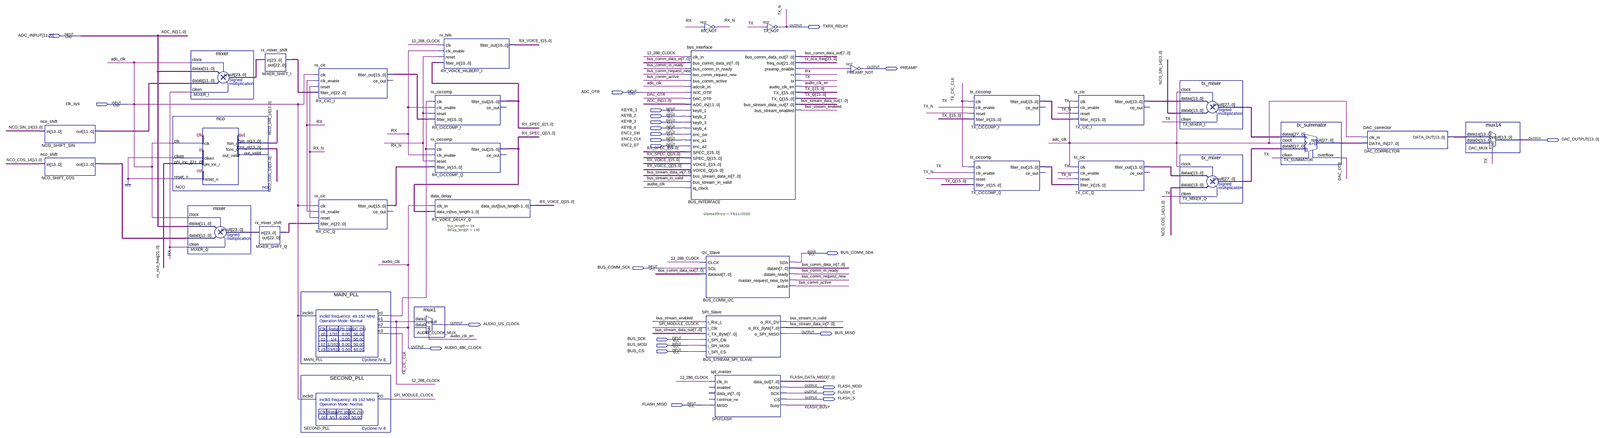
[diagram p0: schematic sheet, whole]
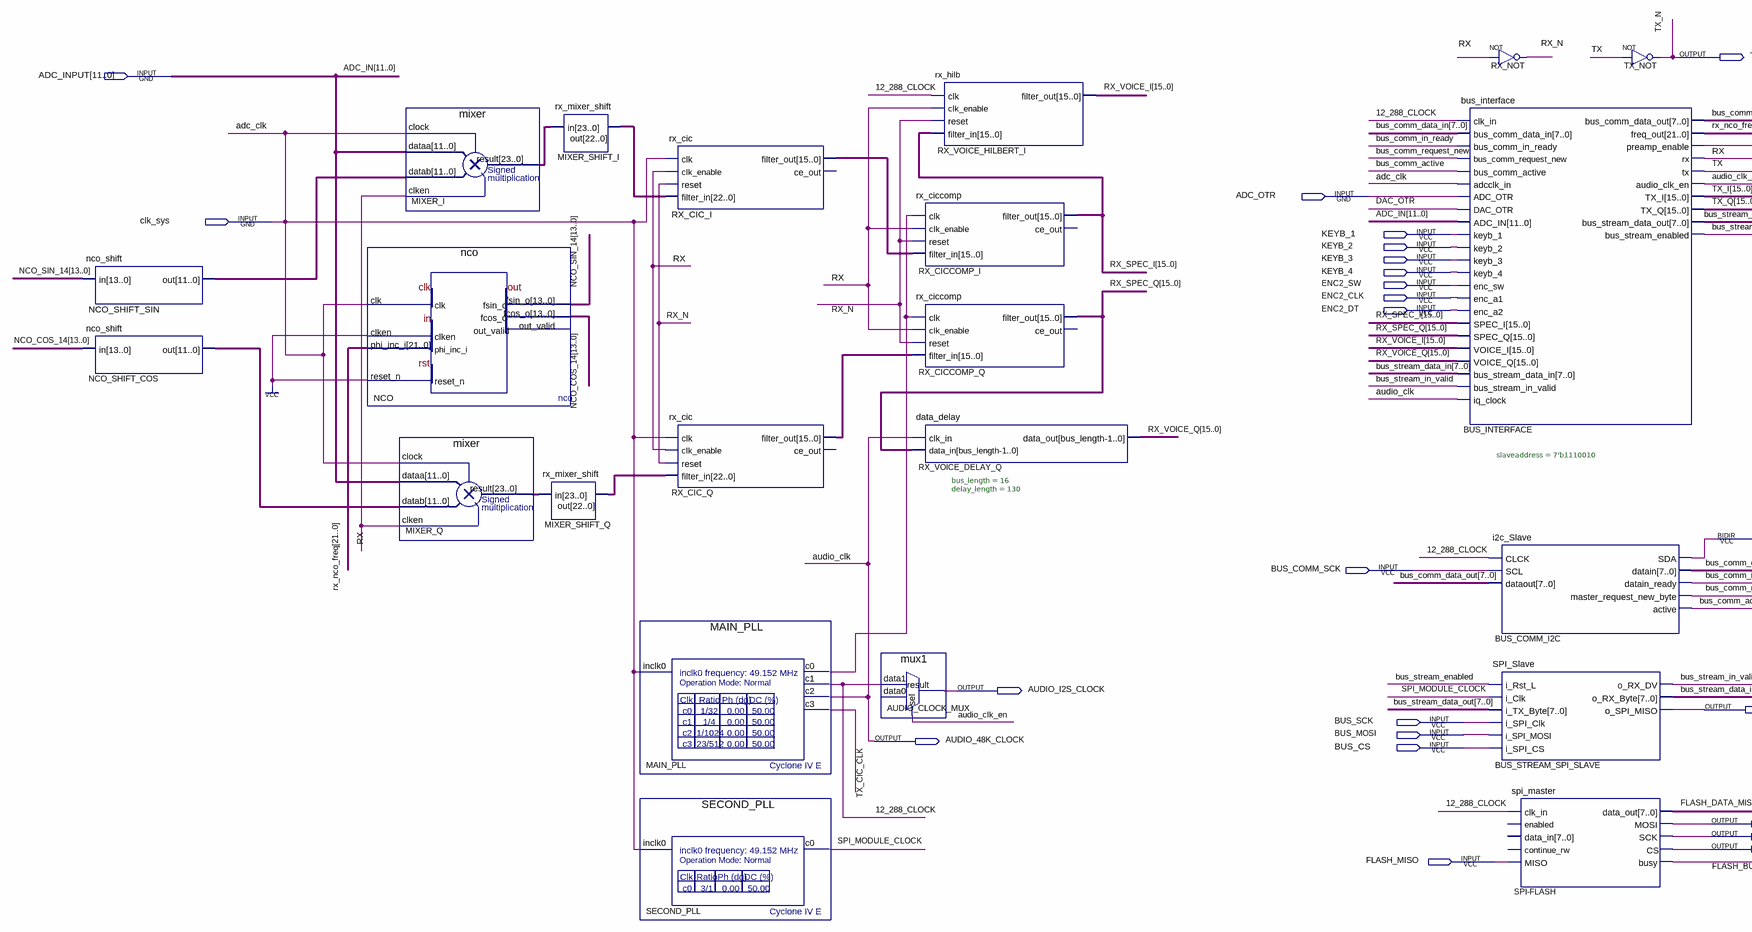
[diagram p1: schematic sheet, left part]
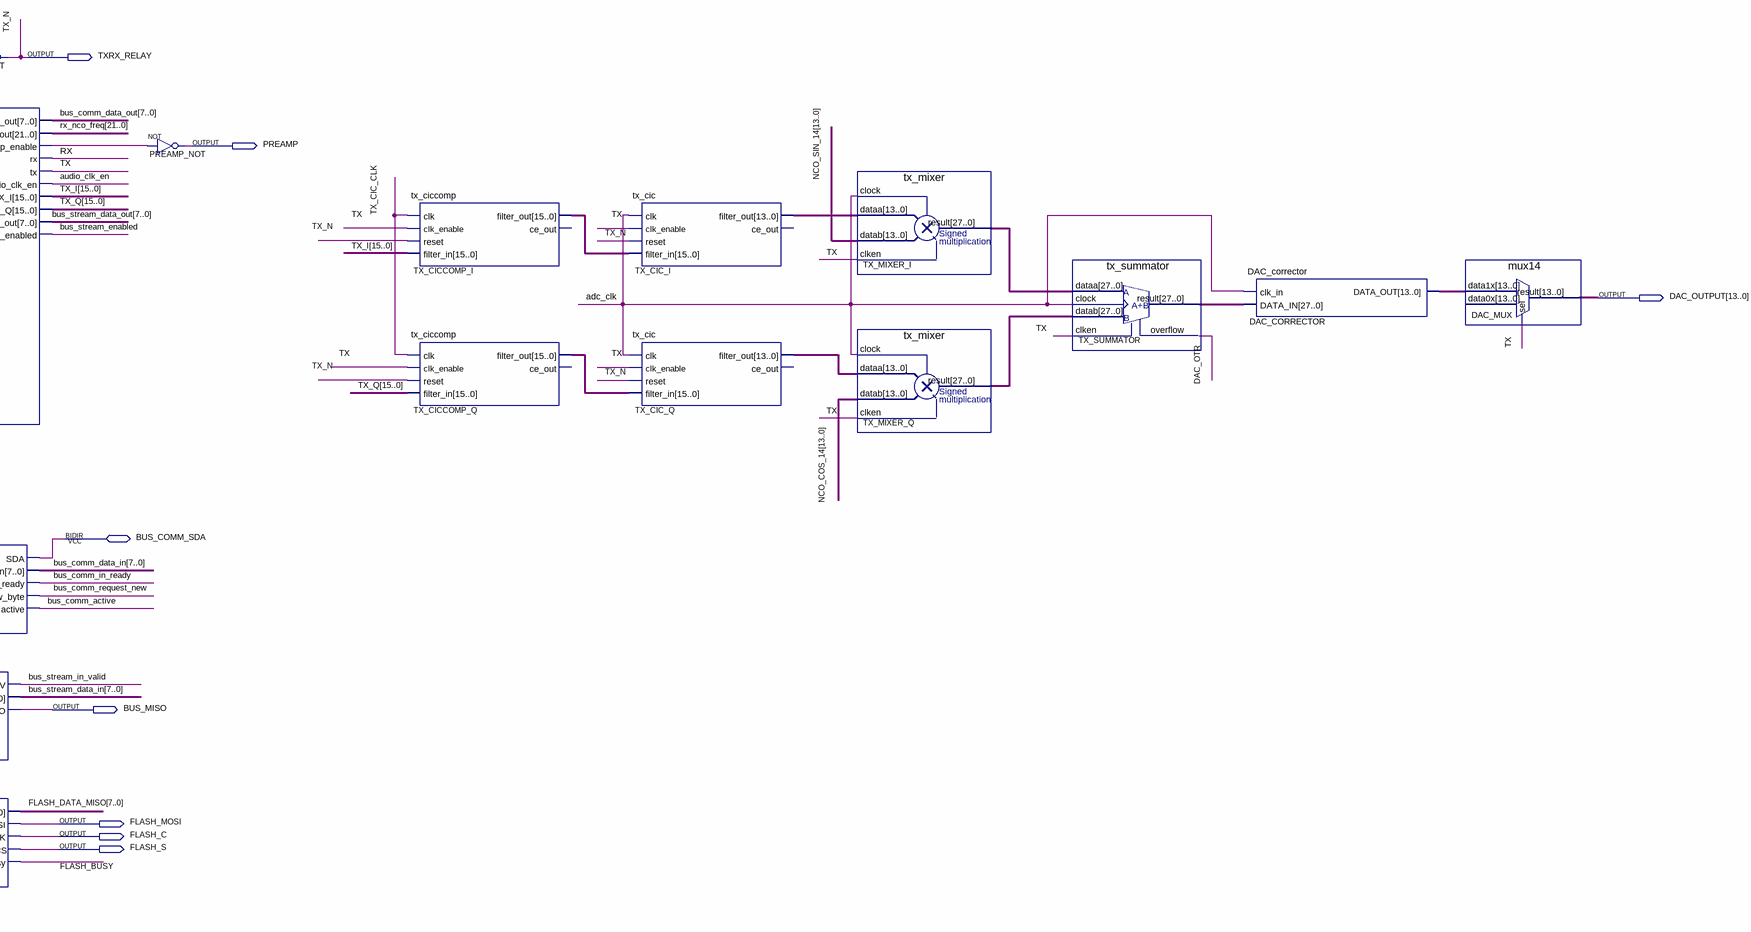
[diagram p2: schematic sheet, right part]
// Quartus schematic UA3REO.bdf as structural Verilog: 32 symbols, 25 pins
module UA3REO (
  input  [11:0] ADC_INPUT,
  input  ADC_OTR,
  input  clk_sys,
  input  KEYB_1,
  input  KEYB_2,
  input  KEYB_3,
  input  KEYB_4,
  input  ENC2_SW,
  input  ENC2_CLK,
  input  ENC2_DT,
  input  BUS_COMM_SCK,
  input  BUS_SCK,
  input  BUS_MOSI,
  input  BUS_CS,
  input  FLASH_MISO,
  inout  BUS_COMM_SDA,
  output TXRX_RELAY,
  output PREAMP,
  output [13:0] DAC_OUTPUT,
  output AUDIO_I2S_CLOCK,
  output BUS_MISO,
  output AUDIO_48K_CLOCK,
  output FLASH_MOSI,
  output FLASH_C,
  output FLASH_S
);

  wire \12_288_CLOCK , audio_clk_en, bus_comm_active, bus_comm_in_ready, bus_comm_request_new,
       BUS_INTERFACE_preamp_enable, bus_stream_enabled, bus_stream_in_valid, DAC_OTR, FLASH_BUSY,
       MAIN_PLL_c0, RX, RX_N, SPI_MODULE_CLOCK, TX, TX_CIC_CLK;
  wire [7:0] bus_comm_data_in, bus_comm_data_out, bus_stream_data_in, bus_stream_data_out, FLASH_DATA_MISO;
  wire [11:0] NCO_SHIFT_COS_out, NCO_SHIFT_SIN_out;
  wire [13:0] DAC_CORRECTOR_data_out, NCO_COS_14, NCO_SIN_14, TX_CIC_I_filter_out, TX_CIC_Q_filter_out;
  wire [15:0] RX_CIC_I_filter_out, RX_CIC_Q_filter_out, RX_SPEC_I, RX_SPEC_Q, RX_VOICE_I, RX_VOICE_Q,
       TX_CICCOMP_I_filter_out, TX_CICCOMP_Q_filter_out, TX_I, TX_Q;
  wire [21:0] rx_nco_freq;
  wire [22:0] MIXER_SHIFT_I_out, MIXER_SHIFT_Q_out;
  wire [23:0] MIXER_I_result, MIXER_Q_result;
  wire [27:0] TX_MIXER_I_result, TX_MIXER_Q_result, TX_SUMMATOR_result;

  nco_shift NCO_SHIFT_SIN (.in(NCO_SIN_14), .out(NCO_SHIFT_SIN_out));
  nco_shift NCO_SHIFT_COS (.in(NCO_COS_14), .out(NCO_SHIFT_COS_out));
  nco NCO (
    .clk(clk_sys), .clken(1'b1), .phi_inc_i(rx_nco_freq), .reset_n(1'b1), .fsin_o(NCO_SIN_14),
    .fcos_o(NCO_COS_14));  // open: out_valid
  mixer MIXER_I (.clock(clk_sys), .dataa(ADC_INPUT), .datab(NCO_SHIFT_SIN_out), .clken(RX), .result(MIXER_I_result));
  mixer MIXER_Q (.clock(clk_sys), .dataa(ADC_INPUT), .datab(NCO_SHIFT_COS_out), .clken(RX), .result(MIXER_Q_result));
  rx_mixer_shift MIXER_SHIFT_Q (.in(MIXER_Q_result), .out(MIXER_SHIFT_Q_out));
  rx_mixer_shift MIXER_SHIFT_I (.in(MIXER_I_result), .out(MIXER_SHIFT_I_out));
  MAIN_PLL MAIN_PLL (.inclk0(clk_sys), .c0(MAIN_PLL_c0), .c1(\12_288_CLOCK ), .c2(AUDIO_48K_CLOCK), .c3(TX_CIC_CLK));
  SECOND_PLL SECOND_PLL (.inclk0(clk_sys), .c0(SPI_MODULE_CLOCK));
  rx_cic RX_CIC_I (
    .clk(clk_sys), .clk_enable(RX), .reset(RX_N), .filter_in(MIXER_SHIFT_I_out),
    .filter_out(RX_CIC_I_filter_out));  // open: ce_out
  rx_cic RX_CIC_Q (
    .clk(clk_sys), .clk_enable(RX), .reset(RX_N), .filter_in(MIXER_SHIFT_Q_out),
    .filter_out(RX_CIC_Q_filter_out));  // open: ce_out
  mux1 AUDIO_CLOCK_MUX (.data1(\12_288_CLOCK ), .sel(audio_clk_en), .result(AUDIO_I2S_CLOCK));  // open: data0
  rx_hilb RX_VOICE_HILBERT_I (
    .clk(\12_288_CLOCK ), .clk_enable(RX), .reset(RX_N), .filter_in(RX_SPEC_I), .filter_out(RX_VOICE_I));
  rx_ciccomp RX_CICCOMP_I (
    .clk(MAIN_PLL_c0), .clk_enable(RX), .reset(RX_N), .filter_in(RX_CIC_I_filter_out), .filter_out(RX_SPEC_I));  // open: ce_out
  rx_ciccomp RX_CICCOMP_Q (
    .clk(MAIN_PLL_c0), .clk_enable(RX), .reset(RX_N), .filter_in(RX_CIC_Q_filter_out), .filter_out(RX_SPEC_Q));  // open: ce_out
  data_delay #(.bus_length(16), .delay_length(130)) RX_VOICE_DELAY_Q (
    .clk_in(AUDIO_48K_CLOCK), .data_in(RX_SPEC_Q), .data_out(RX_VOICE_Q));
  not RX_NOT (RX_N, RX);
  bus_interface BUS_INTERFACE (
    .clk_in(\12_288_CLOCK ), .bus_comm_data_in(bus_comm_data_in), .bus_comm_in_ready(bus_comm_in_ready),
    .bus_comm_request_new(bus_comm_request_new), .bus_comm_active(bus_comm_active), .adcclk_in(clk_sys),
    .ADC_OTR(ADC_OTR), .DAC_OTR(DAC_OTR), .ADC_IN(ADC_INPUT), .keyb_1(KEYB_1), .keyb_2(KEYB_2),
    .keyb_3(KEYB_3), .keyb_4(KEYB_4), .enc_sw(ENC2_SW), .enc_a1(ENC2_CLK), .enc_a2(ENC2_DT),
    .SPEC_I(RX_SPEC_I), .SPEC_Q(RX_SPEC_Q), .VOICE_I(RX_VOICE_I), .VOICE_Q(RX_VOICE_Q),
    .bus_stream_data_in(bus_stream_data_in), .bus_stream_in_valid(bus_stream_in_valid),
    .iq_clock(AUDIO_48K_CLOCK), .bus_comm_data_out(bus_comm_data_out), .freq_out(rx_nco_freq),
    .preamp_enable(BUS_INTERFACE_preamp_enable), .rx(RX), .tx(TX), .audio_clk_en(audio_clk_en), .TX_I(TX_I),
    .TX_Q(TX_Q), .bus_stream_data_out(bus_stream_data_out), .bus_stream_enabled(bus_stream_enabled));
  i2c_Slave #(.slaveaddress(7'b1110010)) BUS_COMM_I2C (
    .CLCK(\12_288_CLOCK ), .SCL(BUS_COMM_SCK), .dataout(bus_comm_data_out), .datain(bus_comm_data_in),
    .datain_ready(bus_comm_in_ready), .master_request_new_byte(bus_comm_request_new),
    .active(bus_comm_active), .SDA(BUS_COMM_SDA));
  SPI_Slave BUS_STREAM_SPI_SLAVE (
    .i_Rst_L(bus_stream_enabled), .i_Clk(SPI_MODULE_CLOCK), .i_TX_Byte(bus_stream_data_out),
    .i_SPI_Clk(BUS_SCK), .i_SPI_MOSI(BUS_MOSI), .i_SPI_CS(BUS_CS), .o_RX_DV(bus_stream_in_valid),
    .o_RX_Byte(bus_stream_data_in), .o_SPI_MISO(BUS_MISO));
  spi_master \SPI-FLASH  (
    .clk_in(\12_288_CLOCK ), .MISO(FLASH_MISO), .data_out(FLASH_DATA_MISO), .MOSI(FLASH_MOSI), .SCK(FLASH_C),
    .CS(FLASH_S), .busy(FLASH_BUSY));  // open: enabled, data_in, continue_rw
  not TX_NOT (TXRX_RELAY, TX);
  not PREAMP_NOT (PREAMP, BUS_INTERFACE_preamp_enable);
  tx_ciccomp TX_CICCOMP_I (
    .clk(TX_CIC_CLK), .clk_enable(TX), .reset(TXRX_RELAY), .filter_in(TX_I),
    .filter_out(TX_CICCOMP_I_filter_out));  // open: ce_out
  tx_ciccomp TX_CICCOMP_Q (
    .clk(TX_CIC_CLK), .clk_enable(TX), .reset(TXRX_RELAY), .filter_in(TX_Q),
    .filter_out(TX_CICCOMP_Q_filter_out));  // open: ce_out
  tx_cic TX_CIC_I (
    .clk(clk_sys), .clk_enable(TX), .reset(TXRX_RELAY), .filter_in(TX_CICCOMP_I_filter_out),
    .filter_out(TX_CIC_I_filter_out));  // open: ce_out
  tx_cic TX_CIC_Q (
    .clk(clk_sys), .clk_enable(TX), .reset(TXRX_RELAY), .filter_in(TX_CICCOMP_Q_filter_out),
    .filter_out(TX_CIC_Q_filter_out));  // open: ce_out
  tx_mixer TX_MIXER_I (
    .clock(clk_sys), .dataa(TX_CIC_I_filter_out), .datab(NCO_SIN_14), .clken(TX), .result(TX_MIXER_I_result));
  tx_mixer TX_MIXER_Q (
    .clock(clk_sys), .dataa(TX_CIC_Q_filter_out), .datab(NCO_COS_14), .clken(TX), .result(TX_MIXER_Q_result));
  tx_summator TX_SUMMATOR (
    .dataa(TX_MIXER_I_result), .datab(TX_MIXER_Q_result), .clken(TX), .clock(clk_sys),
    .result(TX_SUMMATOR_result), .overflow(DAC_OTR));
  DAC_corrector DAC_CORRECTOR (.clk_in(clk_sys), .DATA_IN(TX_SUMMATOR_result), .DATA_OUT(DAC_CORRECTOR_data_out));
  mux14 DAC_MUX (.data1x(DAC_CORRECTOR_data_out), .sel(TX), .result(DAC_OUTPUT));  // open: data0x

  // Other names for the same wires on the sheet: ADC_IN[11:0] = ADC_INPUT; audio_clk = AUDIO_48K_CLOCK;
  //   adc_clk = clk_sys; TX_N = TXRX_RELAY
endmodule
